# Altium schematic sheet Board_Power.SchDoc: Board Power
size A4; Engineer: Jason Skells; SheetNumber: 1; SheetTotal: 4
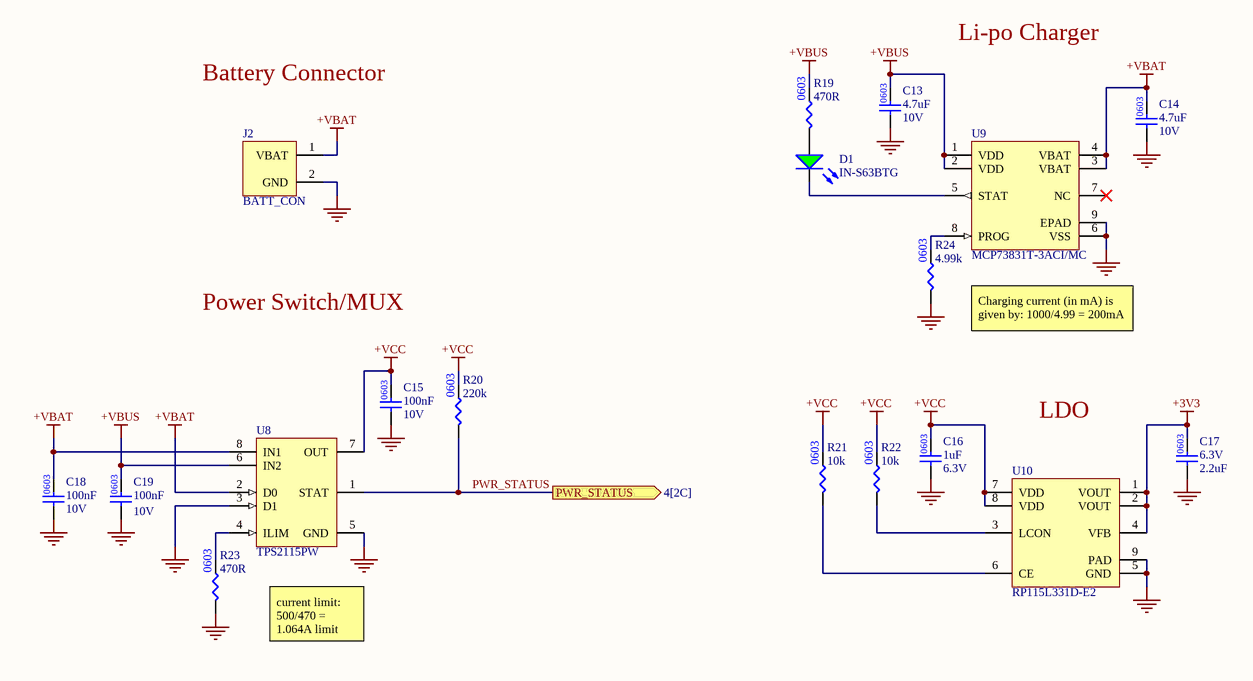
[diagram p0: Board_Power.SchDoc]

## Parts
C13  Capacitance: 4.7uF  Voltage Rating: 10V  [CAP_0603]  (hidden comment: CL10A475KP8NNNC)
C14  Capacitance: 4.7uF  Voltage Rating: 10V  [CAP_0603]  (hidden comment: CL10A475KP8NNNC)
C15  Capacitance: 100nF  Voltage Rating: 10V  [CAP_0603]  (hidden comment: CC0603KRX7R6BB104)
C16  Capacitance: 1uF  Voltage Rating (DC): 6.3V  [CAP_0603]  (hidden comment: CL10A105KQ8NNNC)
C17  Voltage Rating: 6.3V  Capacitance: 2.2uF  [CAP_0603]  (hidden comment: CL10A225KQ8NNNC)
C18  Capacitance: 100nF  Voltage Rating: 10V  [CAP_0603]  (hidden comment: CC0603KRX7R6BB104)
C19  Capacitance: 100nF  Voltage Rating: 10V  [CAP_0603]  (hidden comment: CC0603KRX7R6BB104)
D1  IN-S63BTG  [LED_0603]
J2  BATT_CON  [BATT_CON]
R19  Resistance: 470R  [RES_0603]  (hidden comment: RC0603FR-07470RL)
R20  Resistance: 220k  [RES_0603]  (hidden comment: RMCF0603FT220K)
R21  Resistance: 10k  [RES_0603]  (hidden comment: RNCP0603FTD10K0)
R22  Resistance: 10k  [RES_0603]  (hidden comment: RNCP0603FTD10K0)
R23  Resistance: 470R  [RES_0603]  (hidden comment: RC0603FR-07470RL)
R24  Resistance: 4.99k  [RES_0603]  (hidden comment: RC0603FR-074K99L)
U8  TPS2115PW  [TPS2115PW]
U9  MCP73831T-3ACI/MC  [MCP73831T-3ACI/MC]
U10  RP115L331D-E2  [RP115L331D-E2]

## Ports
PWR_STATUS (out, see 4[2C])

## Nets
+3V3: C17.2 U10.1(VOUT) U10.2(VOUT) U10.4(VFB)
+VBAT: C14.2 C18.2 J2.1(VBAT) U8.2(D0) U8.8(IN1) U9.3(VBAT) U9.4(VBAT)
+VBUS: C13.2 C19.2 R19.2 U8.6(IN2) U9.1(VDD) U9.2(VDD)
+VCC: C15.2 C16.2 R20.2 R21.2 R22.2 U8.7(OUT) U10.7(VDD) U10.8(VDD)
GND: C13.1 C14.1 C15.1 C16.1 C17.1 C18.1 C19.1 J2.2(GND) R23.1 R24.1 U8.3(D1) U8.5(GND) U9.6(VSS) U9.9(EPAD) U10.5(GND) U10.9(PAD)
PWR_STATUS: R20.1 U8.1(STAT) ; port PWR_STATUS
NetD1_1: D1.1(A) R19.1
NetD1_2: D1.2(K) U9.5(STAT)
NetR21_1: R21.1 U10.6(CE)
NetR22_1: R22.1 U10.3(LCON)
NetR23_2: R23.2 U8.4(ILIM)
NetR24_2: R24.2 U9.8(PROG)

Not connected (* = marked no-connect by the designer): U9 7(NC)*

## Notes on the sheet
- Li-po Charger
- Battery Connector
- Power Switch/MUX
- Charging current (in mA) is given by: 1000/4.99 = 200mA
- LDO
- current limit: 500/470 = 1.064A limit

## Library data of the parts
C13 C14 = CL10A475KP8NNNC: CAP CER 4.7UF 10V X5R 0603; Manufacturer: Samsung; Tolerance: 10%; Supplier 1: Digi-Key; Manufacturer Part Number: CL10A475KP8NNNC; RoHS: Yes; Category: Ceramic Capacitors; Stock 1: 5193189; Pricing 1: 1=0.10000, 10=0.04700, 50=0.02580, 100=0.02110, 500=0.01506, 1000=0.01183 (USD); Mount: Surface Mount; Case/Package: 0603; Case Code (Metric): 1608; Case Code (Imperial): 0603; Contact Plating: Tin; Min Operating Temperature: -55°C; Max Operating Temperature: 85°C; Package Quantity: 1; Packaging: Tape and Reel; Dielectric: X5R; Series: CL; Construction: Flat; Length: 1.6mm; Width: 0.031inch; Height: 0.8mm; Thickness: 0.035inch; Depth: 0.8mm; Radiation Hardening: No; RoHS Compliant: Yes; ComponentLink1URL: https://datasheet.ciiva.com/25797/cl10a475kp8nnnc-25797520.pdf?src-supplier=Digi-Key; ComponentLink1Description: https://datasheet.ciiva.com/25797/cl10a475kp8nnnc-25797520.pdf?src-supplier=Digi-Key; ComponentLink2URL: https://datasheet.ciiva.com/26838/getdatasheetpartid-358676-26838384.pdf?src-supplier=Verical; ComponentLink2Description: https://datasheet.ciiva.com/26838/getdatasheetpartid-358676-26838384.pdf?src-supplier=Verical; ComponentLink3URL: https://datasheet.ciiva.com/16318/cl05b104kq5nnnc-16318245.pdf?src-supplier=Future+Electronics; ComponentLink3Description: https://datasheet.ciiva.com/16318/cl05b104kq5nnnc-16318245.pdf?src-supplier=Future+Electronics; Supplier Part Number 1: 1276-1044-1-ND
C15 C18 C19 = CC0603KRX7R6BB104: CAP CER 0.1UF 10V X7R 0603; Manufacturer: Yageo; Tolerance: 10%; Supplier 1: Digi-Key; Manufacturer Part Number: CC0603KRX7R6BB104; RoHS: Yes; Category: Ceramic Capacitors; Stock 1: 135167; Pricing 1: 1=0.11000, 10=0.07700, 50=0.04340, 100=0.03600, 500=0.02522, 1000=0.02089 (USD); Mount: Surface Mount; Case/Package: 0603; Case Code (Imperial): 0603; Case Code (Metric): 1608; Weight: 7.1E-05oz; Min Operating Temperature: -55°C; Max Operating Temperature: 125°C; Dielectric: X7R; Voltage Rating (DC): 10V; Packaging: Tape and Reel; Termination: SMD/SMT; Resistor Type: Ceramic; Series: CC; Construction: Flat; Length: 1.6mm; Width: 0.8mm; Height: 0.8mm; Thickness: 0.035inch; Depth: 0.8mm; Radiation Hardening: No; Lead Free: Lead Free; Halogen Free: Halogen Free; RoHS Compliant: Yes; ComponentLink1URL: https://datasheet.ciiva.com/11586/upy-gphc-x7r-6-3v-to-50v-8-11586327.pdf?src-supplier=Avnet; ComponentLink1Description: https://datasheet.ciiva.com/11586/upy-gphc-x7r-6-3v-to-50v-8-11586327.pdf?src-supplier=Avnet; Supplier Part Number 1: 311-4055-1-ND
C16 = CL10A105KQ8NNNC: CAP CER 1UF 6.3V X5R 0603; Manufacturer: Samsung; Tolerance: 10%; Supplier 1: Digi-Key; Manufacturer Part Number: CL10A105KQ8NNNC; RoHS: Yes; Category: Ceramic Capacitors; Stock 1: 1150582; Pricing 1: 1=0.10000, 10=0.03100, 50=0.01700, 100=0.01390, 500=0.00990, 1000=0.00777 (USD); Mount: Surface Mount; Case/Package: 0603; Case Code (Metric): 1608; Case Code (Imperial): 0603; Min Operating Temperature: -55°C; Max Operating Temperature: 85°C; Dielectric: X5R; Packaging: Tape and Reel; Package Quantity: 1; Voltage Rating: 6.3V; Series: CL; Construction: Flat; Length: 1.6mm; Width: 0.031inch; Height: 0.8mm; Thickness: 0.035inch; Depth: 0.8mm; Radiation Hardening: No; Lead Free: Lead Free; RoHS Compliant: Yes; ComponentLink1URL: https://datasheet.ciiva.com/25801/cl10a105kq8nnnc-25801975.pdf?src-supplier=Digi-Key; ComponentLink1Description: https://datasheet.ciiva.com/25801/cl10a105kq8nnnc-25801975.pdf?src-supplier=Digi-Key; ComponentLink2URL: https://datasheet.ciiva.com/26838/getdatasheetpartid-355285-26838337.pdf?src-supplier=Verical; ComponentLink2Description: https://datasheet.ciiva.com/26838/getdatasheetpartid-355285-26838337.pdf?src-supplier=Verical; ComponentLink3URL: https://datasheet.ciiva.com/16199/cl10a105ko8nnnc-16199274.pdf?src-supplier=Future+Electronics; ComponentLink3Description: https://datasheet.ciiva.com/16199/cl10a105ko8nnnc-16199274.pdf?src-supplier=Future+Electronics; Supplier Part Number 1: 1276-1036-1-ND
C17 = CL10A225KQ8NNNC: CAP CER 2.2UF 6.3V X5R 0603; Manufacturer: Samsung; Tolerance: 10%; Supplier 1: Digi-Key; Manufacturer Part Number: CL10A225KQ8NNNC; RoHS: Yes; Category: Ceramic Capacitors; Stock 1: 697049; Pricing 1: 1=0.10000, 10=0.04200, 50=0.02300, 100=0.01870, 500=0.01336, 1000=0.01050 (USD); Mount: Surface Mount; Case/Package: 0603; Case Code (Metric): 1608; Case Code (Imperial): 0603; Contact Plating: Tin; Min Operating Temperature: -55°C; Max Operating Temperature: 85°C; Packaging: Tape and Reel; Package Quantity: 1; Dielectric: X5R; Voltage Rating (DC): 6.3V; Series: CL; Construction: Flat; Voltage: 6.3V; Length: 1.6mm; Width: 0.031inch; Height: 0.8mm; Thickness: 0.035inch; Depth: 0.8mm; Radiation Hardening: No; Lead Free: Lead Free; RoHS Compliant: Yes; ComponentLink1URL: https://datasheet.ciiva.com/16199/cl10a225kq8nnnc-16199203.pdf?src-supplier=Future+Electronics; ComponentLink1Description: https://datasheet.ciiva.com/16199/cl10a225kq8nnnc-16199203.pdf?src-supplier=Future+Electronics; ComponentLink2URL: https://datasheet.ciiva.com/15195/getdatasheetpartid-358618-15195712.pdf?src-supplier=Verical; ComponentLink2Description: https://datasheet.ciiva.com/15195/getdatasheetpartid-358618-15195712.pdf?src-supplier=Verical; Supplier Part Number 1: 1276-1183-1-ND
D1 = IN-S63BTG: LED Uni-Color Green 530nm 2-Pin Chip 0603(1608Metric) T/R; Manufacturer: Inolux; Supplier 1: Digi-Key; Manufacturer Part Number: IN-S63BTG; RoHS: Yes; Category: LEDs; Stock 1: 10550; Pricing 1: 1=0.33000, 10=0.26300, 100=0.11830, 500=0.10684, 1000=0.08777, 2000=0.07632 (USD); Supplier Part Number 1: 1830-1069-1-ND
J2 = BATT_CON: Pads for Battery Connection
R19 R23 = RC0603FR-07470RL: RES 470 OHM 1% 1/10W 0603; Manufacturer: Yageo; Power Rating: 100mW; Voltage Rating: 50V; Temperature Coefficient: 100ppm/°C; Working Voltage: 75V; Supplier 1: Digi-Key; Manufacturer Part Number: RC0603FR-07470RL; RoHS: Yes; Category: Chip SMD Resistors; Stock 1: 1312688; Pricing 1: 1=0.10000, 10=0.02400, 100=0.00970, 1000=0.00436, 2500=0.00378 (USD); Case/Package: 0603; Case Code (Metric): 1608; Case Code (Imperial): 0603; Min Operating Temperature: -55°C; Max Operating Temperature: 155°C; Tolerance: 1%; Packaging: Tape and Reel; Package Quantity: 1; Resistor Type: Thick Film; Number of Terminations: 2; Termination: SMD/SMT; Max Power Dissipation: 100mW; Features: Moisture Resistant; Series: RC; Technology: THICK FILM; Resistance Tolerance: 1%; Construction: Rectangular; Length: 1.6mm; Width: 0.031inch; Height: 0.022inch; Depth: 0.8mm; RoHS Compliant: Yes; REACH SVHC: No SVHC; Military Standard: Not; Lead Free: Lead Free; ComponentLink1URL: https://datasheet.ciiva.com/11808/0900766b80f96399-11808177.pdf?src-supplier=RSComponents; ComponentLink1Description: https://datasheet.ciiva.com/11808/0900766b80f96399-11808177.pdf?src-supplier=RSComponents; ComponentLink2URL: https://datasheet.ciiva.com/7660/1868787-7660793.pdf?src-supplier=Element14; ComponentLink2Description: https://datasheet.ciiva.com/7660/1868787-7660793.pdf?src-supplier=Element14; ComponentLink3URL: https://datasheet.ciiva.com/46440/1868787-46440907.pdf?src-supplier=Element14; ComponentLink3Description: https://datasheet.ciiva.com/46440/1868787-46440907.pdf?src-supplier=Element14; ComponentLink4URL: https://datasheet.ciiva.com/2454/pyu-r-int-thick-7-2454013.pdf?src-supplier=Digi-Key; ComponentLink4Description: https://datasheet.ciiva.com/2454/pyu-r-int-thick-7-2454013.pdf?src-supplier=Digi-Key; ComponentLink5URL: https://datasheet.ciiva.com/2454/pyu-r-int-thick-7-2454014.pdf?src-supplier=Digi-Key; ComponentLink5Description: https://datasheet.ciiva.com/2454/pyu-r-int-thick-7-2454014.pdf?src-supplier=Digi-Key; ComponentLink6URL: https://datasheet.ciiva.com/2454/pyu-r-int-thick-7-2454012.pdf?src-supplier=Digi-Key; ComponentLink6Description: https://datasheet.ciiva.com/2454/pyu-r-int-thick-7-2454012.pdf?src-supplier=Digi-Key; ComponentLink7URL: https://datasheet.ciiva.com/7746/1738695-7746359.pdf?src-supplier=Element14; ComponentLink7Description: https://datasheet.ciiva.com/7746/1738695-7746359.pdf?src-supplier=Element14; ComponentLink8URL: https://datasheet.ciiva.com/7746/1738695-7746360.pdf?src-supplier=Element14; ComponentLink8Description: https://datasheet.ciiva.com/7746/1738695-7746360.pdf?src-supplier=Element14; Supplier Part Number 1: 311-470HRCT-ND
R20 = RMCF0603FT220K: Res Thick Film 0603 220K Ohm 1% 0.1W(1/10W) ±100ppm/C Pad SMD Automotive T/R; Manufacturer: Stackpole Electronics; Max Power Dissipation: 100mW; Temperature Coefficient: 100ppm/°C; Supplier 1: Digi-Key; Manufacturer Part Number: RMCF0603FT220K; RoHS: Yes; Category: Chip SMD Resistors; Stock 1: 3017881; Pricing 1: 1=0.10000, 10=0.01700, 100=0.00680, 1000=0.00305, 2500=0.00264 (USD); Mount: Surface Mount; Case/Package: 0603; Case Code (Metric): 1608; Case Code (Imperial): 0603; Contact Plating: Tin,Matte; Min Operating Temperature: -55°C; Max Operating Temperature: 155°C; Tolerance: 1%; Packaging: Tape and Reel; Resistor Type: Thick Film; Number of Terminations: 2; Features: Automotive AEC-Q200; Series: RMCF; Construction: Rectangular; Length: 0.061inch; Width: 0.031inch; Height: 0.022inch; Depth: 0.8mm; Radiation Hardening: No; Military Standard: Not; Lead Free: Lead Free; RoHS Compliant: Yes; ComponentLink1URL: https://datasheet.ciiva.com/26835/getdatasheetpartid-479010-26835622.pdf?src-supplier=Verical; ComponentLink1Description: https://datasheet.ciiva.com/26835/getdatasheetpartid-479010-26835622.pdf?src-supplier=Verical; Supplier Part Number 1: RMCF0603FT220KCT-ND
R21 R22 = RNCP0603FTD10K0: Res Thin Film 0603 10K Ohm 1% 1/8W ±100ppm/°C Molded SMD SMD Paper T/R; Manufacturer: Stackpole Electronics; Max Power Dissipation: 125mW; Supplier 1: Digi-Key; Manufacturer Part Number: RNCP0603FTD10K0; RoHS: Yes; Category: Chip SMD Resistors; Stock 1: 2737524; Pricing 1: 1=0.10000, 10=0.06100, 100=0.02480, 1000=0.01113, 2500=0.00966 (USD); Mount: Surface Mount; Case/Package: 0603; Case Code (Metric): 1608; Case Code (Imperial): 0603; Contact Plating: Tin,Matte; Min Operating Temperature: -55°C; Max Operating Temperature: 155°C; Packaging: Tape and Reel; Tolerance: 1%; Resistor Type: Thin Film; Number of Terminations: 2; Temperature Coefficient: 100ppm/°C; Features: Moisture Resistant,Anti-Sulfur; Series: RNCP; Length: 0.059inch; Width: 0.031inch; Height: 0.02inch; Radiation Hardening: No; Lead Free: Lead Free; RoHS Compliant: Yes; ComponentLink1URL: https://www.seielect.com/Catalog/SEI-rncp.pdf?src-supplier=Avnet; ComponentLink1Description: https://www.seielect.com/Catalog/SEI-rncp.pdf?src-supplier=Avnet; ComponentLink2URL: https://www.seielect.com/Catalog/SEI-rncp.pdf?src-supplier=Digi-Key; ComponentLink2Description: https://www.seielect.com/Catalog/SEI-rncp.pdf?src-supplier=Digi-Key; ComponentLink3URL: https://www.seielect.com/catalog/SEI-Packaging.pdf?src-supplier=Digi-Key; ComponentLink3Description: https://www.seielect.com/catalog/SEI-Packaging.pdf?src-supplier=Digi-Key; Supplier Part Number 1: RNCP0603FTD10K0CT-ND
R24 = RC0603FR-074K99L: RES 4.99K OHM 1% 1/10W 0603; Manufacturer: Yageo; Voltage Rating: 75V; Power Rating: 100mW; Temperature Coefficient: 100ppm/°C; Voltage Rating (DC): 50V; Supplier 1: Digi-Key; Manufacturer Part Number: RC0603FR-074K99L; RoHS: Yes; Category: Chip SMD Resistors; Stock 1: 5200913; Pricing 1: 1=0.10000, 10=0.02400, 100=0.00970, 1000=0.00436, 2500=0.00378 (USD); Case/Package: 0603; Number of Pins: 2; Case Code (Imperial): 0603; Case Code (Metric): 1608; Weight: 7.1E-05oz; Size Code: 0603; Min Operating Temperature: -55°C; Max Operating Temperature: 155°C; Packaging: Tape and Reel; Tolerance: 1%; Package Quantity: 1; Termination: SMD/SMT; Resistor Type: Thick Film; Number of Terminations: 2; Max Power Dissipation: 100mW; Features: Moisture Resistant; Series: RC; Construction: Rectangular; Resistance Tolerance: 1%; Length: 1.6mm; Width: 0.8mm; Height: 0.022inch; Depth: 0.8mm; REACH SVHC: Unknown; Military Standard: Not; Lead Free: Lead Free; RoHS Compliant: Yes; ComponentLink1URL: https://datasheet.ciiva.com/7983/443971-7983646.pdf?src-supplier=Element14; ComponentLink1Description: https://datasheet.ciiva.com/7983/443971-7983646.pdf?src-supplier=Element14; ComponentLink2URL: https://datasheet.ciiva.com/22747/443971-22747529.pdf?src-supplier=Element14; ComponentLink2Description: https://datasheet.ciiva.com/22747/443971-22747529.pdf?src-supplier=Element14; ComponentLink3URL: https://datasheet.ciiva.com/2453/pyu-r-int-thick-7-2453980.pdf?src-supplier=Digi-Key; ComponentLink3Description: https://datasheet.ciiva.com/2453/pyu-r-int-thick-7-2453980.pdf?src-supplier=Digi-Key; ComponentLink4URL: https://datasheet.ciiva.com/2453/pyu-r-int-thick-7-2453981.pdf?src-supplier=Digi-Key; ComponentLink4Description: https://datasheet.ciiva.com/2453/pyu-r-int-thick-7-2453981.pdf?src-supplier=Digi-Key; ComponentLink5URL: https://datasheet.ciiva.com/2453/pyu-r-int-thick-7-2453979.pdf?src-supplier=Digi-Key; ComponentLink5Description: https://datasheet.ciiva.com/2453/pyu-r-int-thick-7-2453979.pdf?src-supplier=Digi-Key; Supplier Part Number 1: 311-4.99KHRCT-ND
U8 = TPS2115PW: Pwr Mux Autoswitch 1.5V to 5.5V 1.25A 8-Pin TSSOP Tube; Manufacturer: Texas Instruments; Number of Outputs: 1; Number of Inputs: 2; Min Input Voltage: 2.8V; Turn-On Delay Time: 1ms; Max Power Dissipation: 386.84mW; On-State Resistance: 84mR; Max Supply Current: 55uA; Output Voltage: 6V; Supplier 1: Digi-Key; Manufacturer Part Number: TPS2115PW; RoHS: Yes; Category: Voltage Regulators - Switching; Stock 1: 1098; Pricing 1: 1=2.94000, 10=2.63600, 25=2.49240, 100=2.16000, 250=2.04924, 500=1.83878, 1000=1.82875 (USD); Case/Package: TSSOP; Number of Pins: 8; Weight: 0.001376oz; Min Operating Temperature: -40°C; Max Operating Temperature: 85°C; Output Current: 1.25A; Packaging: Rail/Tube; Package Quantity: 150; Max Output Current: 1.25A; Max Input Voltage: 5.5V; Current - Output 2: 1.25A; Operating Supply Voltage: 5.5V; Series: -; Length: 3mm; Width: 4.4mm; Height: 1.15mm; Radiation Hardening: No; Lead Free: Lead Free; RoHS Compliant: Yes; REACH SVHC: No SVHC; ComponentLink1URL: https://datasheet.ciiva.com/1960/tps2114-1960868.pdf?src-supplier=Digi-Key; ComponentLink1Description: https://datasheet.ciiva.com/1960/tps2114-1960868.pdf?src-supplier=Digi-Key; ComponentLink2URL: https://datasheet.ciiva.com/4923/slvs447a-206199-4923489.pdf?src-supplier=Mouser; ComponentLink2Description: https://datasheet.ciiva.com/4923/slvs447a-206199-4923489.pdf?src-supplier=Mouser; ComponentLink3URL: https://datasheet.ciiva.com/3232/tps2115-3232474.pdf?src-supplier=Avnet; ComponentLink3Description: https://datasheet.ciiva.com/3232/tps2115-3232474.pdf?src-supplier=Avnet; Supplier Part Number 1: 296-14207-5-ND
U9 = MCP73831T-3ACI/MC: Battery Management - Advanced Lithium-Ion/-Polymer Charge mgnt contr; Manufacturer: Microchip; Output Voltage: 4.35V; Output Current: 500mA; Min Supply Voltage: 3.75V; Max Supply Voltage: 6V; Supplier 1: Digi-Key; Manufacturer Part Number: MCP73831T-3ACI/MC; RoHS: Yes; Category: Battery Management; Stock 1: 1670; Pricing 1: 1=0.83000, 25=0.69960, 100=0.64500 (USD); Mount: Surface Mount; Case/Package: DFN; Number of Pins: 8; Min Operating Temperature: -40°C; Max Operating Temperature: 85°C; Packaging: Tape and Reel; Package Quantity: 3300; Radiation Hardening: No; Lead Free: Lead Free; RoHS Compliant: Yes; ComponentLink1URL: https://datasheet.ciiva.com/3215/21984e-3215301.pdf?src-supplier=Avnet; ComponentLink1Description: https://datasheet.ciiva.com/3215/21984e-3215301.pdf?src-supplier=Avnet; ComponentLink2URL: https://datasheet.ciiva.com/1933/21984e-1933408.pdf?src-supplier=Digi-Key; ComponentLink2Description: https://datasheet.ciiva.com/1933/21984e-1933408.pdf?src-supplier=Digi-Key; Supplier Part Number 1: MCP73831T-3ACI/MCCT-ND
U10 = RP115L331D-E2: LDO Regulator Pos 3.3V 0.5A/1A 8-Pin DFN EP T/R; Manufacturer: Ricoh; Supplier 1: Digi-Key; Manufacturer Part Number: RP115L331D-E2; RoHS: No; Category: Voltage Regulators - Linear; Supplier Part Number 1: 2129-RP115L331D-E2CT-ND